# EAGLE schematic PCB_Socket (EAGLE 6.5.0)
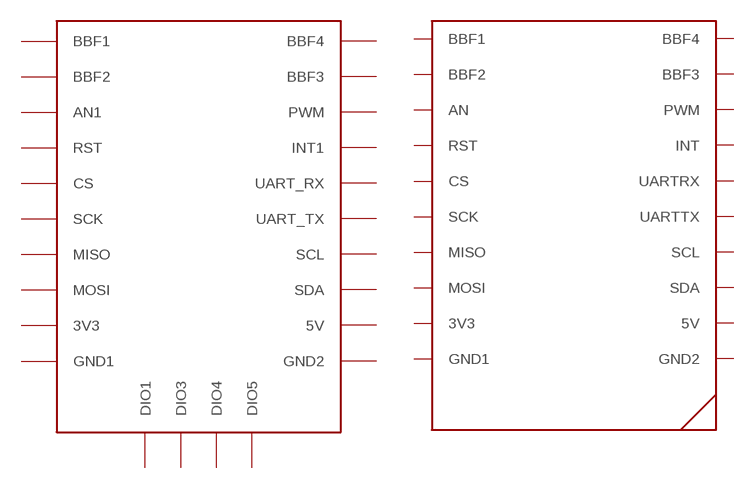
[diagram p0: schematic, sheet 1]

## Parts
MB1  BBF_PCB_SOCKETDEFAULT  [BBF_PCB_SOCKET]
MBI  BOARD_BBFRIENDLY  [BOARD_BBFRIENDLY]
Unconnected: MB1.3V3 MB1.5V MB1.AN MB1.BBF1 MB1.BBF2 MB1.BBF3 MB1.BBF4 MB1.CS MB1.GND1 MB1.GND2 MB1.INT MB1.MISO MB1.MOSI MB1.PWM MB1.RST MB1.SCK MB1.SCL MB1.SDA MB1.UARTRX MB1.UARTTX MBI.3V3 MBI.5V MBI.AN1 MBI.BBF1 MBI.BBF2 MBI.BBF3 MBI.BBF4 MBI.CS MBI.DIO1 MBI.DIO3 MBI.DIO4 MBI.DIO5 MBI.GND1 MBI.GND2 MBI.INT(INT1) MBI.MISO MBI.MOSI MBI.PWM MBI.RST MBI.RX(UART_RX) MBI.SCK MBI.SCL MBI.SDA MBI.TX(UART_TX)

## Library data of the parts
MB1 = My_Mikrobus:BBF_PCB_SOCKET
MBI = My_Mikrobus:BOARD_BBFRIENDLY

## Net classes
0 default: width 0.203 mm
1 POWER: width 0.635 mm
2 VDD: width 0.635 mm